# EAGLE design Final_PCB_2 (EAGLE 8.1.0)
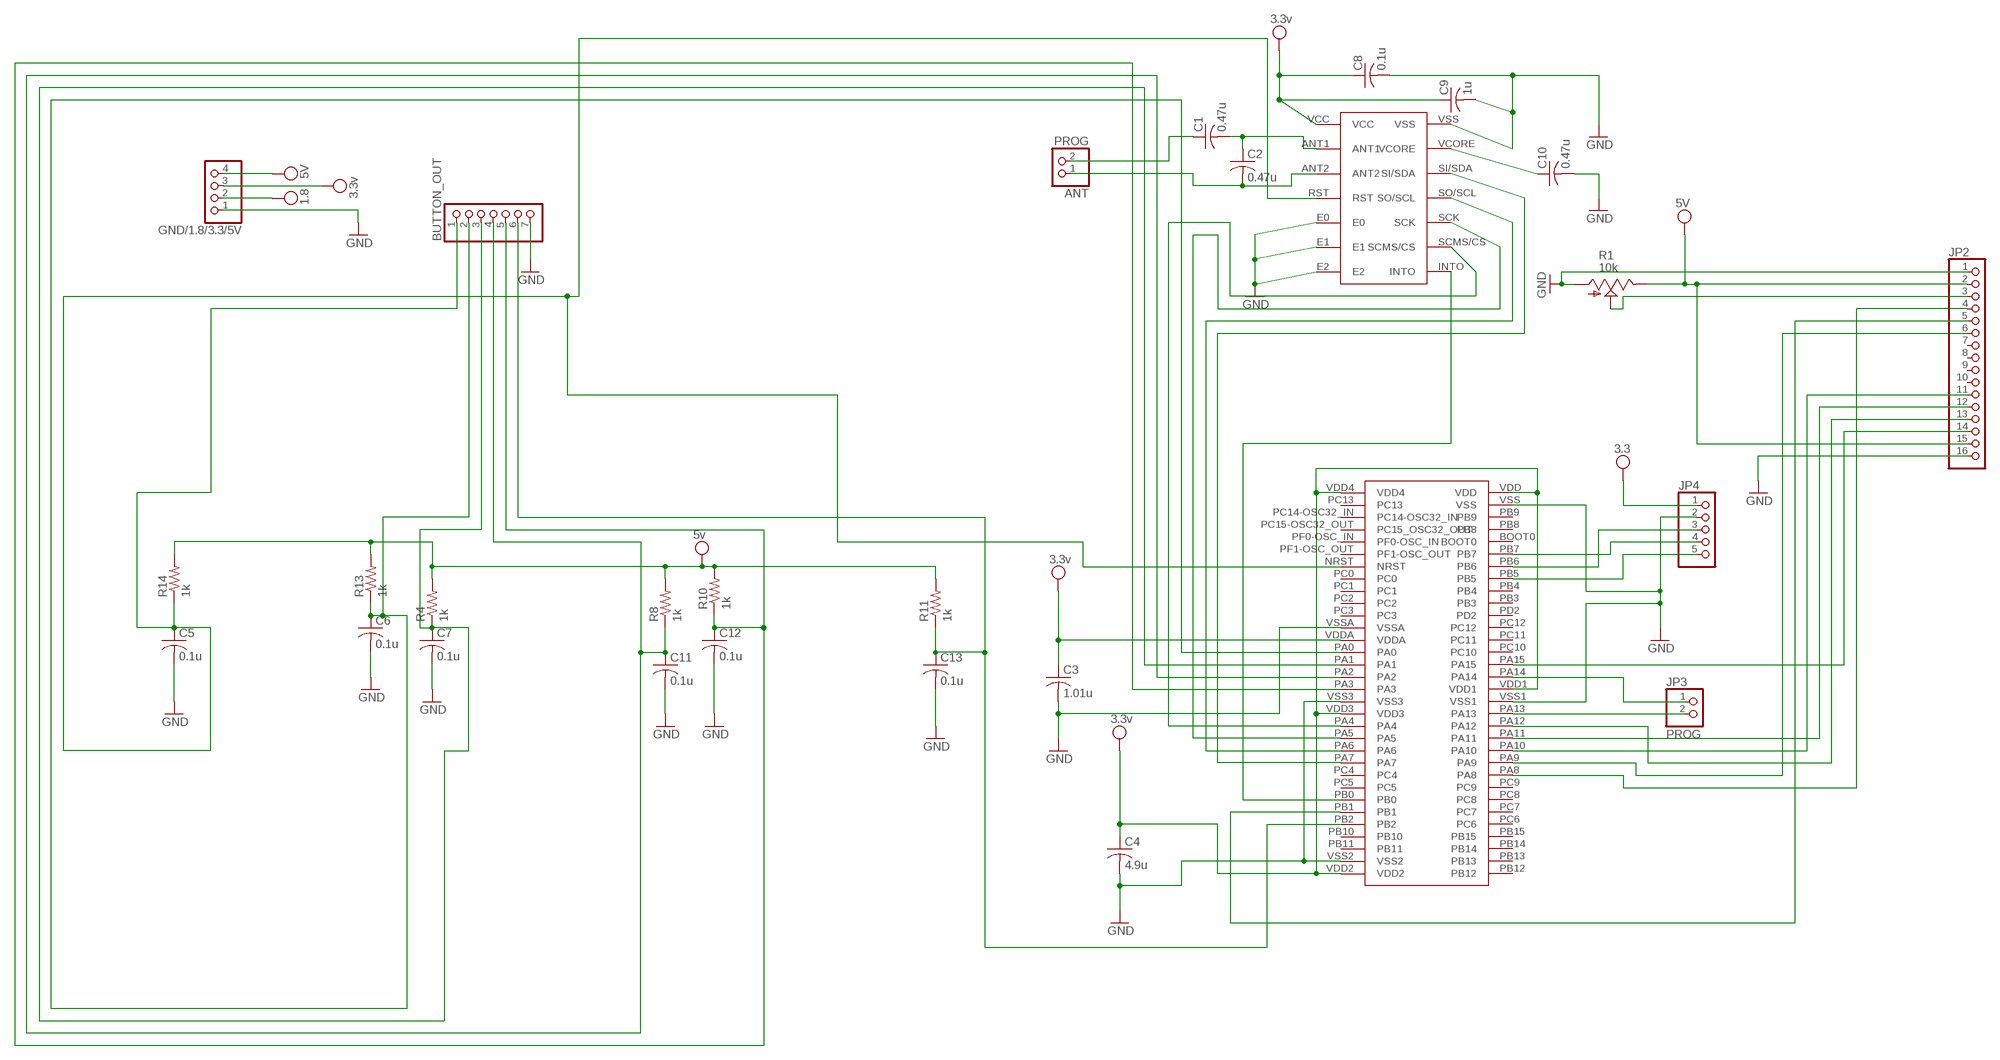
[diagram p0: schematic, sheet 1]

## Parts
ANT  PROG  PINHD-1X2  [1X02]
BUTTON_OUT  PINHD-1X7  [1X07]
C1  0.47u  C-USC0805  [C0805]
C2  0.47u  C-USC0805  [C0805]
C3  1.01u  C-USC0805  [C0805]
C4  4.9u  C-USC0805  [C0805]
C5  0.1u  C-USC0805  [C0805]
C6  0.1u  C-USC0805  [C0805]
C7  0.1u  C-USC0805  [C0805]
C8  0.1u  C-USC0805  [C0805]
C9  1u  C-USC0805  [C0805]
C10  0.47u  C-USC0805  [C0805]
C11  0.1u  C-USC0805  [C0805]
C12  0.1u  C-USC0805  [C0805]
C13  0.1u  C-USC0805  [C0805]
GND/1.8/3.3/5V  PINHD-1X4/90  [1X04/90]
JP2  PINHD-1X16  [1X16]
JP3  PROG  PINHD-1X2  [1X02]
JP4  PINHD-1X5  [1X05]
R1  10k  TRIM_US-B64Y  [B64Y]
R4  1k  R-US_R0805  [R0805]
R8  1k  R-US_R0805  [R0805]
R10  1k  R-US_R0805  [R0805]
R11  1k  R-US_R0805  [R0805]
R13  1k  R-US_R0805  [R0805]
R14  1k  R-US_R0805  [R0805]
U$2  LQFP64  [LQFP64]
U$7  RF430CL330H  [RF430CL330H]

## Nets
GND: BUTTON_OUT.7 C3.2 C4.2 C5.2 C6.2 C7.2 C8.2 C9.2 C10.2 C11.2 C12.2 C13.2 GND/1.8/3.3/5V.1 JP2.1 JP2.16 JP4.2 R1.A U$2.VSS U$2.VSS1 U$2.VSS2 U$2.VSS3 U$2.VSSA U$7.E0 U$7.E1 U$7.E2 U$7.VSS
N$1: U$2.PB0 U$7.INTO
N$2: U$2.PA5 U$7.SCK
N$3: U$2.PA6 U$7.SO/SCL
N$4: U$2.PA7 U$7.SI/SDA
N$5: JP2.5 U$2.PB1
N$6: ANT.1 C2.2 U$7.ANT2
N$7: U$2.PA4 U$7.SCMS/CS
N$8: C1.2 C2.1 U$7.ANT1
N$9: BUTTON_OUT.3 C7.1 R4.1 U$2.PA1
N$10: ANT.2 C1.1
N$13: C10.1 U$7.VCORE
N$14: JP2.3 R1.S
N$15: JP2.4 U$2.PA8
N$16: JP2.6 U$2.PA9
N$17: JP2.11 U$2.PA10
N$18: JP2.12 U$2.PA11
N$19: JP2.13 U$2.PA12
N$20: JP2.14 U$2.PA15
N$23: BUTTON_OUT.5 C12.1 R10.1 U$2.PA3
N$29: BUTTON_OUT.4 C11.1 R8.1 U$2.PA2
N$31: JP3.1 U$2.PA14
N$32: JP4.5 U$2.PB5
N$35: JP4.3 U$2.PB6
N$36: BUTTON_OUT.6 C13.1 R11.1 U$2.PB2
N$40: BUTTON_OUT.1 C5.1 R14.1 U$2.NRST U$7.RST
N$44: BUTTON_OUT.2 C6.1 R13.1 U$2.PA0
N$47: JP4.4 U$2.PB7
SWDIO: JP3.2 U$2.PA13
VCC: C3.1 C4.1 C8.1 C9.1 GND/1.8/3.3/5V.3 JP4.1 U$2.VDD U$2.VDD1 U$2.VDD2 U$2.VDD3 U$2.VDD4 U$2.VDDA U$7.VCC ; supply symbol labelled 3.3v, 3.3
VDD: GND/1.8/3.3/5V.4 JP2.2 JP2.15 R1.E R4.2 R8.2 R10.2 R11.2 R13.2 R14.2 ; supply symbol labelled 5V, 5v
VEE: GND/1.8/3.3/5V.2 ; supply symbol labelled 1.8
Unconnected: JP2.7 JP2.8 JP2.9 JP2.10 U$2.BOOT0 U$2.PB3 U$2.PB4 U$2.PB8 U$2.PB9 U$2.PB10 U$2.PB11 U$2.PB12 U$2.PB13 U$2.PB14 U$2.PB15 U$2.PC0 U$2.PC1 U$2.PC2 U$2.PC3 U$2.PC4 U$2.PC5 U$2.PC6 U$2.PC7 U$2.PC8 U$2.PC9 U$2.PC10 U$2.PC11 U$2.PC12 U$2.PC13 U$2.PC14-OSC32_IN U$2.PC15-OSC32_OUT(PC15_OSC32_OUT) U$2.PD2 U$2.PF0-OSC_IN U$2.PF1-OSC_OUT

## Library data of the parts
ANT JP3 = pinhead:PINHD-1X2: PIN HEADER
BUTTON_OUT = pinhead:PINHD-1X7: PIN HEADER
C1-C13 = rcl:C-US: CAPACITOR, American symbol
GND/1.8/3.3/5V = pinhead:PINHD-1X4: PIN HEADER
JP2 = pinhead:PINHD-1X16: PIN HEADER
JP4 = pinhead:PINHD-1X5: PIN HEADER
R1 = pot:TRIM_US-: POTENTIOMETER
R4 R8 R10 R11 R13 R14 = rcl:R-US_: RESISTOR, American symbol
U$2 = nxp_packages:LQFP64
U$7 = RF430CL330H:RF430CL330H

## Board
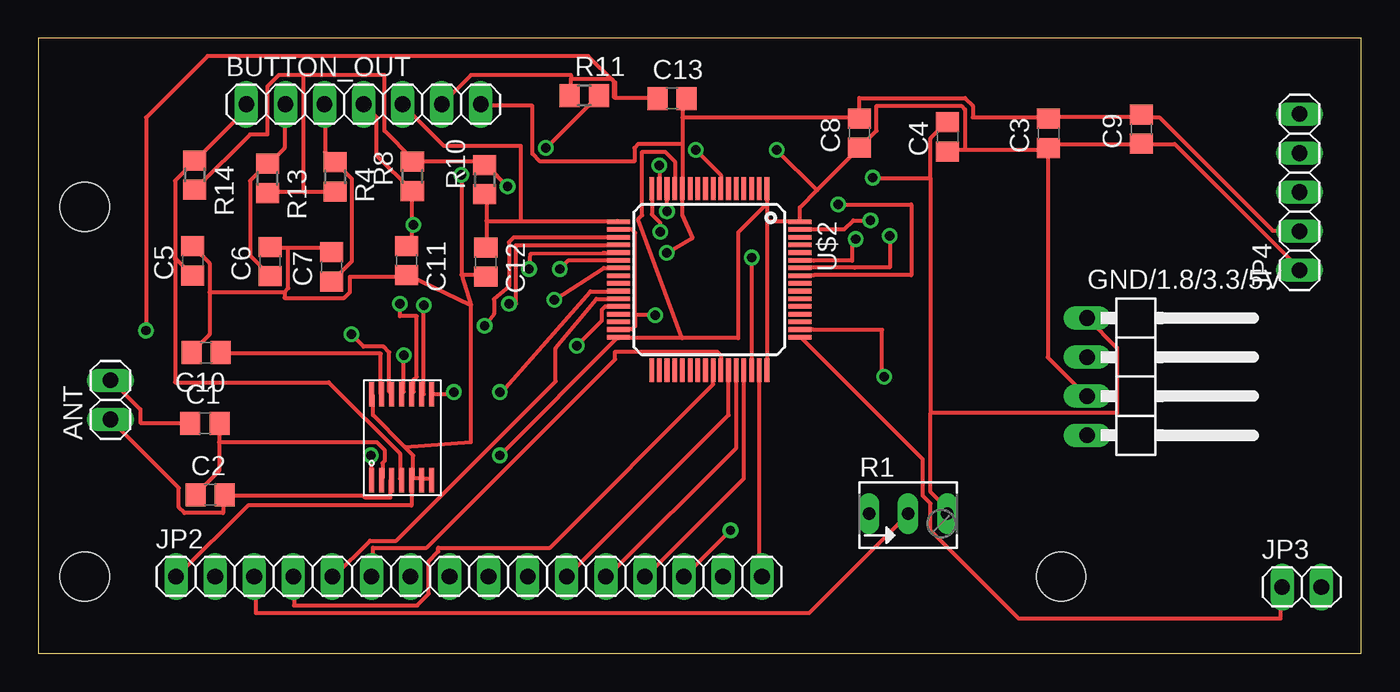
[diagram p1: board, top side]
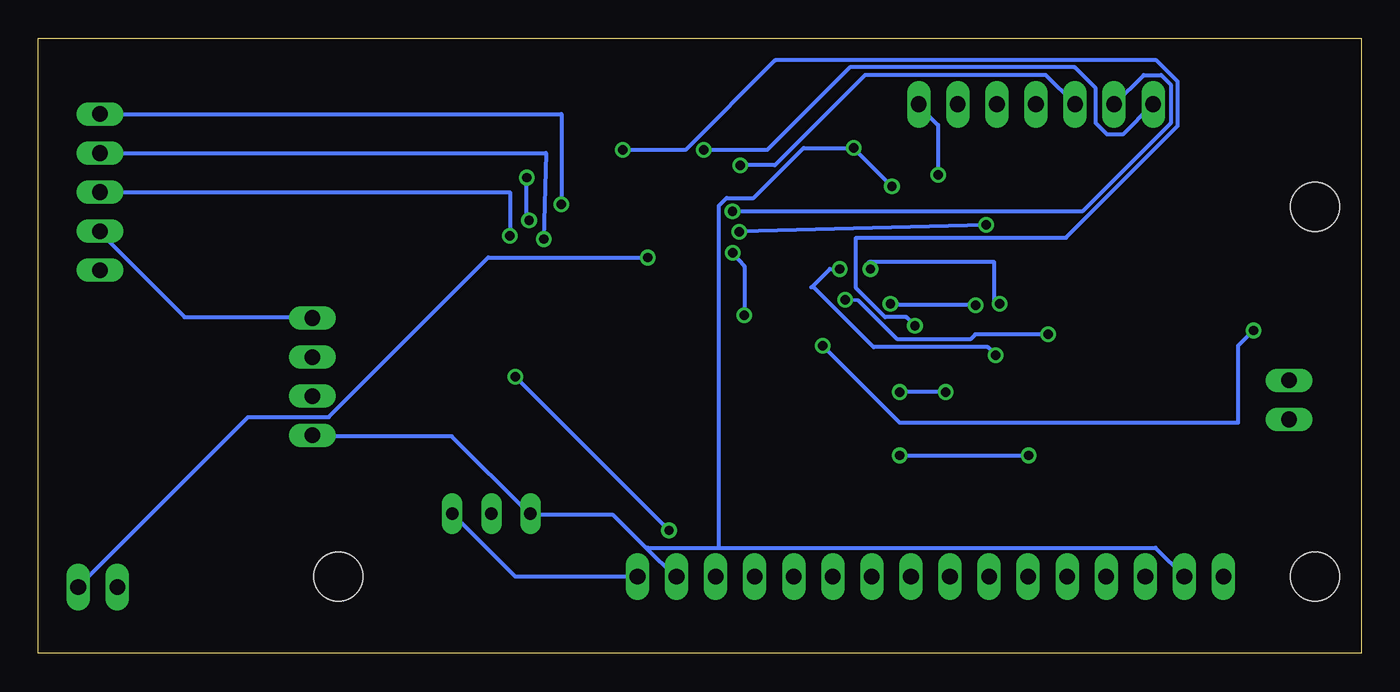
[diagram p2: board, bottom side, seen from below]

Size 86 x 40 mm. Coordinates in mm from the lower left corner, seen from the top.
Outline: 0,0 86,0 86,40 0,40 0,0
Copper layers (1*16): Top 0.035mm / dielectric 1.5mm / Bottom 0.035mm
Design rules "default": minimum track width 10mil, minimum drill 24mil, track to track 8mil, track to pad 8mil, pad to pad 8mil, via to via 8mil, smd to smd 8mil, copper to edge 40mil, drill to drill 8mil, minimum pad ring 10mil, minimum via ring 8mil, stop-mask expansion 4mil, vias tented up to drill 0mil, thermal gap 10mil
Holes 3.2 mm at 3,29.05 3,5 66.5,5

### Footprints (pad centres in the part's own frame; a part is rotated, then mirrored left to right if it is on the bottom)
1X02 = drill 1.016 long: 1 -1.27,0; 2 1.27,0
1X07 = drill 1.016 long: 1 -7.62,0; 2 -5.08,0; 3 -2.54,0; 4 0,0; 5 2.54,0; 6 5.08,0; 7 7.62,0
C0805 = smd 1.3 x 1.5: 1 -0.95,0; 2 0.95,0
1X04/90 = drill 1.016 long: 1 -3.81,-3.81; 2 -1.27,-3.81; 3 1.27,-3.81; 4 3.81,-3.81
1X16 = drill 1.016 long: 1 -19.05,0; 2 -16.51,0; 3 -13.97,0; 4 -11.43,0; 5 -8.89,0; 6 -6.35,0; 7 -3.81,0; 8 -1.27,0; 9 1.27,0; 10 3.81,0; 11 6.35,0; 12 8.89,0; 13 11.43,0; 14 13.97,0; 15 16.51,0; 16 19.05,0
1X05 = drill 1.016 long: 1 -5.08,0; 2 -2.54,0; 3 0,0; 4 2.54,0; 5 5.08,0
B64Y = drill 0.813 long: A 2.54,0; E -2.54,0; S 0,0
R0805 = smd 1.3 x 1.5: 1 -0.95,0; 2 0.95,0
LQFP64 = smd 0.3 x 1.5: BOOT0 -1.75,5.9; PA3 -3.75,-5.9; PA4 -2.25,-5.9; PA5 -1.75,-5.9; PA6 -1.25,-5.9; PA7 -0.75,-5.9; PA14 3.75,5.9; PA15 3.25,5.9; PB0 0.75,-5.9; PB1 1.25,-5.9; PB2 1.75,-5.9; PB3 0.75,5.9; PB4 0.25,5.9; PB5 -0.25,5.9; PB6 -0.75,5.9; PB7 -1.25,5.9; PB8 -2.25,5.9; PB9 -2.75,5.9; PB10 2.25,-5.9; PB11 2.75,-5.9; PC4 -0.25,-5.9; PC5 0.25,-5.9; PC10 2.75,5.9; PC11 2.25,5.9; PC12 1.75,5.9; PD2 1.25,5.9; VDD -3.75,5.9; VDD2 3.75,-5.9; VDD3 -2.75,-5.9; VSS -3.25,5.9; VSS2 3.25,-5.9; VSS3 -3.25,-5.9 | smd 1.5 x 0.3: NRST -5.9,0.75; PA0 -5.9,-2.75; PA1 -5.9,-3.25; PA2 -5.9,-3.75; PA8 5.9,0.25; PA9 5.9,0.75; PA10 5.9,1.25; PA11 5.9,1.75; PA12 5.9,2.25; PA13 5.9,2.75; PB12 5.9,-3.75; PB13 5.9,-3.25; PB14 5.9,-2.75; PB15 5.9,-2.25; PC0 -5.9,0.25; PC1 -5.9,-0.25; PC2 -5.9,-0.75; PC3 -5.9,-1.25; PC6 5.9,-1.75; PC7 5.9,-1.25; PC8 5.9,-0.75; PC9 5.9,-0.25; PC13 -5.9,3.25; PC14-OSC32_IN -5.9,2.75; PC15-OSC32_OUT -5.9,2.25; PF0-OSC_IN -5.9,1.75; PF1-OSC_OUT -5.9,1.25; VDD1 5.9,3.75; VDD4 -5.9,3.75; VDDA -5.9,-2.25; VSS1 5.9,3.25; VSSA -5.9,-1.75
RF430CL330H = smd 0.35 x 1.6: ANT1 0.65,0; ANT2 1.3,0; E0 2.6,0; E1 3.25,0; E2 3.9,0; INTO 3.9,5.6; RST 1.95,0; SCK 2.6,5.6; SCMS/CS 3.25,5.6; SI/SDA 1.3,5.6; SO/SCL 1.95,5.6; VCC 0,0; VCORE 0.65,5.6; VSS 0,5.6

### Placement (x,y rotation side)
ANT  4.68,16.49 90 top
BUTTON_OUT  21.14,35.72 0 top
C1  10.82,14.97 0 top
C2  11.17,10.32 0 top
C3  65.68,33.82 90 top
C4  59.11,33.6 90 top
C5  10.04,25.54 90 top
C6  15.06,25.49 90 top
C7  19.06,25.14 90 top
C8  53.38,33.84 90 top
C9  71.71,34.09 90 top
C10  10.91,19.56 180 top
C11  23.94,25.56 270 top
C12  29.09,25.46 270 top
C13  41.19,36.09 0 top
GND/1.8/3.3/5V  72,18 270 top
JP2  28,5 0 top
JP3  82.14,4.32 0 top
JP4  82,30 90 top
R1  56.55,9.08 0 top
R4  19.29,30.99 270 top
R8  24.31,31.03 90 top
R10  29.01,30.81 90 top
R11  35.49,36.29 0 top
R13  14.89,30.89 270 top
R14  10.16,31.11 270 top
U$2  43.62,24.32 270 top
U$7  21.66,11.27 0 top

### Tracks (layer width: path | path; a pad name or v marks a point on that pad's centre or on a via)
GND  (via drill 0.61)
  Top 0.254: U$2.VSS1 46.88,18.38 46.88,5.12 47,5 JP2.16 | 58,15.62 58,10.5 59,9.5 59,9.12 R1.A | 58,30.9 58,15.62 | 58,30.9 58,33.5 59,34.5 C4.2 | 27.5,24.62 29,24.62 C12.2 | 27.5,24.62 28.12,22.62 | 28.12,22.62 24,24.62 C11.2 23.88,24.5 20.25,24.5 20.25,23.5 19.88,23.12 16,23.12 16,23.5 | 16.25,26.38 19,26.38 19,26.12 C7.2 | 16.25,26.38 15.12,26.38 C6.2 | 11.12,23.5 11.12,25.38 10.12,26.38 C5.2 | 11.12,23.5 11.12,20.75 10,19.62 C10.2 | 16.25,26.38 16.25,23.75 16,23.5 | 11.12,23.5 16,23.5 | U$7.E0 24.38,11.38 24.88,11.38 U$7.E1 25,11.38 25.5,11.38 U$7.E2 | 23.81,13.44 24.38,12.88 24.38,11.5 U$7.E0 | 23.81,13.44 21.75,15.5 21.75,16.75 U$7.VSS | JP2.1 9,5 13.62,9.62 24.25,9.62 24.25,11.25 U$7.E0 | 28.12,22.62 28.12,13.75 23.81,13.44 | 41.88,34.88 41.88,35.75 42.12,36 C13.2 | 41.88,34.88 41.88,33.12 | 41.88,33.12 41.88,30.25 U$2.VSSA 41.85,30.2 41.85,28.54 42.52,27.01 v40.87,26.05 | 41.88,34.88 53.38,34.88 C8.2 53.38,35 53.38,36.12 60.25,36.12 60.75,35.62 60.75,34.88 65.62,34.88 C3.2 65.75,34.88 71.62,34.88 71.62,35 C9.2 71.75,34.88 72.88,34.88 80.25,27.5 82,27.5 JP4.2 | 41.88,33.12 39,33.12 38.75,32.88 38.75,32 32.62,32 32.12,32.5 32.12,35.62 28.88,35.62 BUTTON_OUT.7 | v27.5,31.12 27.5,24.62 | 58,15.62 70.12,15.62 70.12,19.88 GND/1.8/3.3/5V.1 | 38.8,22 38.8,21.28 38.61,21.09 37.74,21.09 U$2.VSS2 | 38.8,22 38.8,27.36 38.61,27.55 37.74,27.55 U$2.VSS3 | U$2.VSS 49.54,27.59 52.41,27.59 52.99,28.17 v54.1,28.17 | v54.25,30.95 54.3,30.9 58,30.9 | v40.1,22 38.8,22
  Bottom 0.254: JP2.16 55,5 59,9 R1.A | GND/1.8/3.3/5V.1 68.25,21.88 76.5,21.88 82,27.38 JP4.2 | v27.5,31.12 27.5,34.38 28.75,35.62 BUTTON_OUT.7 | v54.1,28.17 54.25,28.32 v54.25,30.95 | v40.87,26.05 40.1,25.18 v40.1,22
N$1  (via drill 0.61)
  Top 0.254: U$7.INTO 27,16.87 v27,17 | U$2.PB0 37.7,23.55 35.89,23.55 30.14,17 v30,17
  Bottom 0.254: v27,17 v30,17
N$2  (via drill 0.61)
  Top 0.254: U$7.SCK 24.41,17.02 24.41,17.81 24.59,18 24.59,21.93 23.5,21.93 v23.5,22.75 | v31.9,25 32,26 36.73,26.05 36.83,26.05 37.7,26.05 U$2.PA5
  Bottom 0.254: v23.5,22.75 23.85,22.75 23.85,25.45 32,25.45 v31.9,25
N$3  (via drill 0.61)
  Top 0.254: U$7.SO/SCL 23.75,17.01 v23.75,19.4 | v33.9,25 34.47,25.57 34.58,25.57 U$2.PA6
  Bottom 0.254: v23.75,19.4 24.27,19.92 31.7,19.92 35.58,23.8 35.75,23.8 34.55,25 v33.9,25
N$4  (via drill 0.61)
  Top 0.254: v33.55,23 36.77,25.07 U$2.PA7 | U$7.SI/SDA 22.82,17.02 22.82,19.58 22.44,19.96 21.14,19.96 v20.35,20.75
  Bottom 0.254: v33.55,23 32.67,22.95 30.14,20.42 25.42,20.42 25.08,20.75 v20.35,20.75
N$5
  Top 0.254: U$2.PB1 37.7,23.05 36.28,23.05 33.64,19.86 33.64,17.7 23.27,7.33 21.56,7.33 19.23,5 JP2.5
N$6
  Top 0.254: U$7.ANT2 22.88,11.25 22.88,10.12 21.25,10.12 21.12,10.25 12.12,10.25 C2.2 12,10.25 12,9.12 9.5,9.12 9.12,9.5 9.12,10.75 4.75,15.12 ANT.1
N$7  (via drill 0.61)
  Top 0.254: U$7.SCMS/CS 25.05,16.87 v25.05,22.65 | v30.6,22.75 31.05,22.7 31.05,26.55 36.83,26.55 | 36.83,26.55 | 36.83,26.55 37.7,26.55 U$2.PA4
  Bottom 0.254: v25.05,22.65 30.6,22.65 v30.6,22.75
N$8
  Top 0.254: 11.75,13.75 11.75,14.88 C1.2 | 11.75,13.75 11.75,11.88 10.25,10.38 C2.1 | 11.75,13.75 22,13.75 22.5,13.25 22.5,12.5 22.38,12.38 22.38,11.38 U$7.ANT1
N$9  (via drill 0.61)
  Top 0.254: C7.1 19.12,24.25 20.38,25.5 20.38,30.88 19.38,31.88 R4.1 19.25,32 18.62,32.62 18.62,35.62 BUTTON_OUT.3 | v40.38,31.75 40.38,30.25 U$2.PA1
  Bottom 0.254: v40.38,31.75 38.12,31.75 32.25,37.62 20.5,37.62 18.62,35.75 BUTTON_OUT.3
N$10
  Top 0.254: C1.1 9.75,15 6.62,15 6.62,15.88 4.75,17.75 ANT.2
N$13
  Top 0.254: C10.1 11.88,19.5 22.25,19.5 22.25,16.88 U$7.VCORE
N$14
  Top 0.254: R1.S 56.5,9 50.12,2.62 14.12,2.62 14.12,5 JP2.3
N$15
  Top 0.254: U$2.PA8 43.88,18.38 43.88,17.5 33.25,6.88 26,6.88 26,6.62 25.38,6 25.38,3.88 24.62,3.12 16.62,3.12 16.62,5 JP2.4
N$16
  Top 0.254: U$2.PA9 44.38,18.5 44.38,19.38 44.12,19.62 37.5,19.62 37.5,19.12 25.25,6.88 21.75,6.88 21.75,5 JP2.6
N$17
  Top 0.254: U$2.PA10 44.88,18.38 44.88,15.5 34.38,5 JP2.11
N$18
  Top 0.254: U$2.PA11 45.38,18.38 45.38,13.38 37,5 JP2.12
N$19
  Top 0.254: U$2.PA12 45.88,18.38 45.88,11.38 39.5,5 JP2.13
N$20  (via drill 0.61)
  Top 0.254: JP2.14 42,5 v45,8 | v55,18 54.85,18 54.85,21.05 50.41,21.05 | 50.41,21.05 | U$2.PA15 49.53,21.05 50.4,21.05 50.41,21.05
  Bottom 0.254: v45,8 v55,18
N$23
  Top 0.254: 29.12,28.12 29.12,29.75 R10.1 | 29.12,28.12 29.12,26.5 C12.1 | 29.12,28.12 31.38,28.12 | 31.38,28.12 37.62,28.12 U$2.PA3 | 31.38,28.12 31.38,33 26.38,33 23.75,35.62 BUTTON_OUT.5
N$29  (via drill 0.61)
  Top 0.254: 24.25,27.88 24.25,30 R8.1 24.25,30.12 22,32.38 22,34.88 21.25,35.62 BUTTON_OUT.4 | 24.25,27.88 24.25,26.88 24,26.62 C11.1 | 39.88,30.27 U$2.PA2 39.89,30.2 39.89,28.55 40.42,28.02 v40.42,27.43 | v24.38,27.88 24.25,27.88
  Bottom 0.254: v24.38,27.88 v40.42,27.43
N$31
  Top 0.254: U$2.PA14 49.62,20.5 57.5,12.62 57.5,10.25 58,9.75 58,8 63.75,2.25 80.75,2.25 80.75,4.25 JP3.1
N$32  (via drill 0.61)
  Top 0.254: v52,29.2 56.75,29.2 56.75,24.6 50.42,24.6 50.41,24.59 49.54,24.59 U$2.PB5
  Bottom 0.254: JP4.5 52,35.08 v52,29.2
N$35  (via drill 0.61)
  Top 0.254: v55.35,27.15 55.35,25.1 53.1,25.1 53.09,25.09 49.54,25.09 U$2.PB6
  Bottom 0.254: JP4.3 55.35,30 v55.35,27.15
N$36  (via drill 0.61)
  Top 0.254: 37.5,36.12 40.12,36.12 C13.1 | 37.5,36.12 37.5,37.12 37.25,37.38 34.62,37.38 | 34.62,37.38 34.62,36.38 R11.1 | BUTTON_OUT.6 28.12,37.62 34.62,37.62 34.62,37.38 | 37.5,36.12 37.42,36.2 37.42,37.18 35.74,38.86 11,38.86 7,34.86 v7,21 | v35,20 36.64,21.64 36.64,22.36 36.85,22.57 U$2.PB2
  Bottom 0.254: v7,21 8,20 8,15 30,15 v35,20
N$40  (via drill 0.61)
  Top 0.254: 8.94,25.69 8.88,25.75 8.88,30.75 10.12,32 R14.1 10.25,32.12 13.5,35.38 13.5,35.62 BUTTON_OUT.1 | 8.94,25.69 10,24.62 C5.1 | U$7.RST 23.5,11.38 23.5,13 18.88,17.62 8.88,17.62 8.88,25.62 8.94,25.69 | v42.75,32.75 44.38,31.12 44.38,30.25 U$2.NRST
  Bottom 0.254: v42.75,32.75 38.62,32.75 33.25,38.12 18.62,38.12 17.25,36.75 17.25,34.5 16.5,33.75 15.5,33.75 13.62,35.62 BUTTON_OUT.1
N$44  (via drill 0.61)
  Top 0.254: BUTTON_OUT.2 16,35.62 16,32.88 15,31.88 R13.1 14.88,31.88 13.75,30.75 13.75,25.88 15,24.62 C6.1 | v40.88,28.75 40.88,30.12 U$2.PA0
  Bottom 0.254: v40.88,28.75 18.12,28.75 12.38,34.5 12.38,37 13,37.62 14.12,37.62 16,35.75 BUTTON_OUT.2
N$47  (via drill 0.61)
  Top 0.254: v53.15,26.95 52.9,27 52.9,25.55 50.41,25.55 | 50.41,25.55 | 50.41,25.55 49.54,25.55 U$2.PB7
  Bottom 0.254: JP4.4 53,32.54 v53.15,26.95
SWDIO  (via drill 0.61)
  Top 0.254: v46.38,25.75 46.38,18.5 U$2.PA13
  Bottom 0.254: v46.38,25.75 56.75,25.75 67.12,15.38 72.38,15.38 83.38,4.38 JP3.2
VCC  (via drill 0.61)
  Top 0.254: 60.25,32.75 65.62,32.75 C3.1 | 60.25,32.75 59.12,32.75 C4.1 | C3.1 65.75,32.88 65.75,33.12 71.62,33.12 C9.1 71.75,33.12 73.88,33.12 82,25 JP4.1 | GND/1.8/3.3/5V.3 68.12,16.75 65.62,19.25 65.62,32.62 C3.1 | 41.85,20.5 45.5,20.5 45.5,27.38 47.31,29.19 | 41.85,20.5 37.75,20.5 U$2.VDD2 37.62,20.5 v30,12.88 | 47.31,29.19 47.38,29.25 47.38,30.12 U$2.VDD4 | 41.85,20.5 39,28.25 39.25,28.5 39.25,32.62 40.75,32.62 41.38,32 41.38,30.25 U$2.VDDA | 47.38,28.12 47.38,29.12 47.31,29.19 | 47.38,28.12 47.38,18.5 U$2.VDD1 | 47.38,28.12 49.5,28.12 | 49.5,28.12 U$2.VDD | 50.62,30.12 49.5,29 49.5,28.12 | 50.62,30.12 C8.1 54.5,34 54.5,35.62 60,35.62 60.25,35.38 60.25,32.75 | v21.62,12.88 21.62,11.38 U$7.VCC | U$2.VDD3 37.7,27.05 30.9,27.05 30.59,26.74 30.59,23.87 29.62,23.05 29.62,22.06 v29.01,21.3 | v48,32.75 50.62,30.12
  Bottom 0.254: v30,12.88 v21.62,12.88 | v48,32.75 43.94,32.75 38.1,38.58 13.31,38.58 11.92,37.19 11.92,34.31 19.19,27.04 32.83,27.04 32.83,23.75 30.95,21.87 29.57,21.87 v29.01,21.3
VDD  (via drill 0.61)
  Top 0.254: 17.25,30 19.25,30 R4.2 | 17.25,30 15,30 R13.2 | 17.25,37.62 15.62,37.62 14.88,36.88 14.88,33.75 13.75,33.75 10.25,30.25 R14.2 | 17.25,30 17.25,37.62 | v33,32.88 36.38,36.25 R11.2 | v30.5,30.38 29.12,31.75 R10.2 29,31.88 29,32 24.38,32 R8.2 24.38,32.12 22.5,34 22.5,37.62 17.25,37.62
  Bottom 0.254: v30.5,30.38 v33,32.88 36.25,32.88 39.5,29.62 41.25,29.62 41.75,29.12 41.75,6.88 | 46.44,6.81 44.62,5 JP2.15 | 46.44,6.81 48.62,9 54,9 R1.E 54.12,9.12 59.12,14.12 68.12,14.12 GND/1.8/3.3/5V.4 | 41.75,6.88 46.38,6.88 46.44,6.81 | 41.75,6.88 13.38,6.88 JP2.2